# Altium schematic sheet Sheet_1.SchDoc
size A4; SheetNumber: 1; SheetTotal: 1
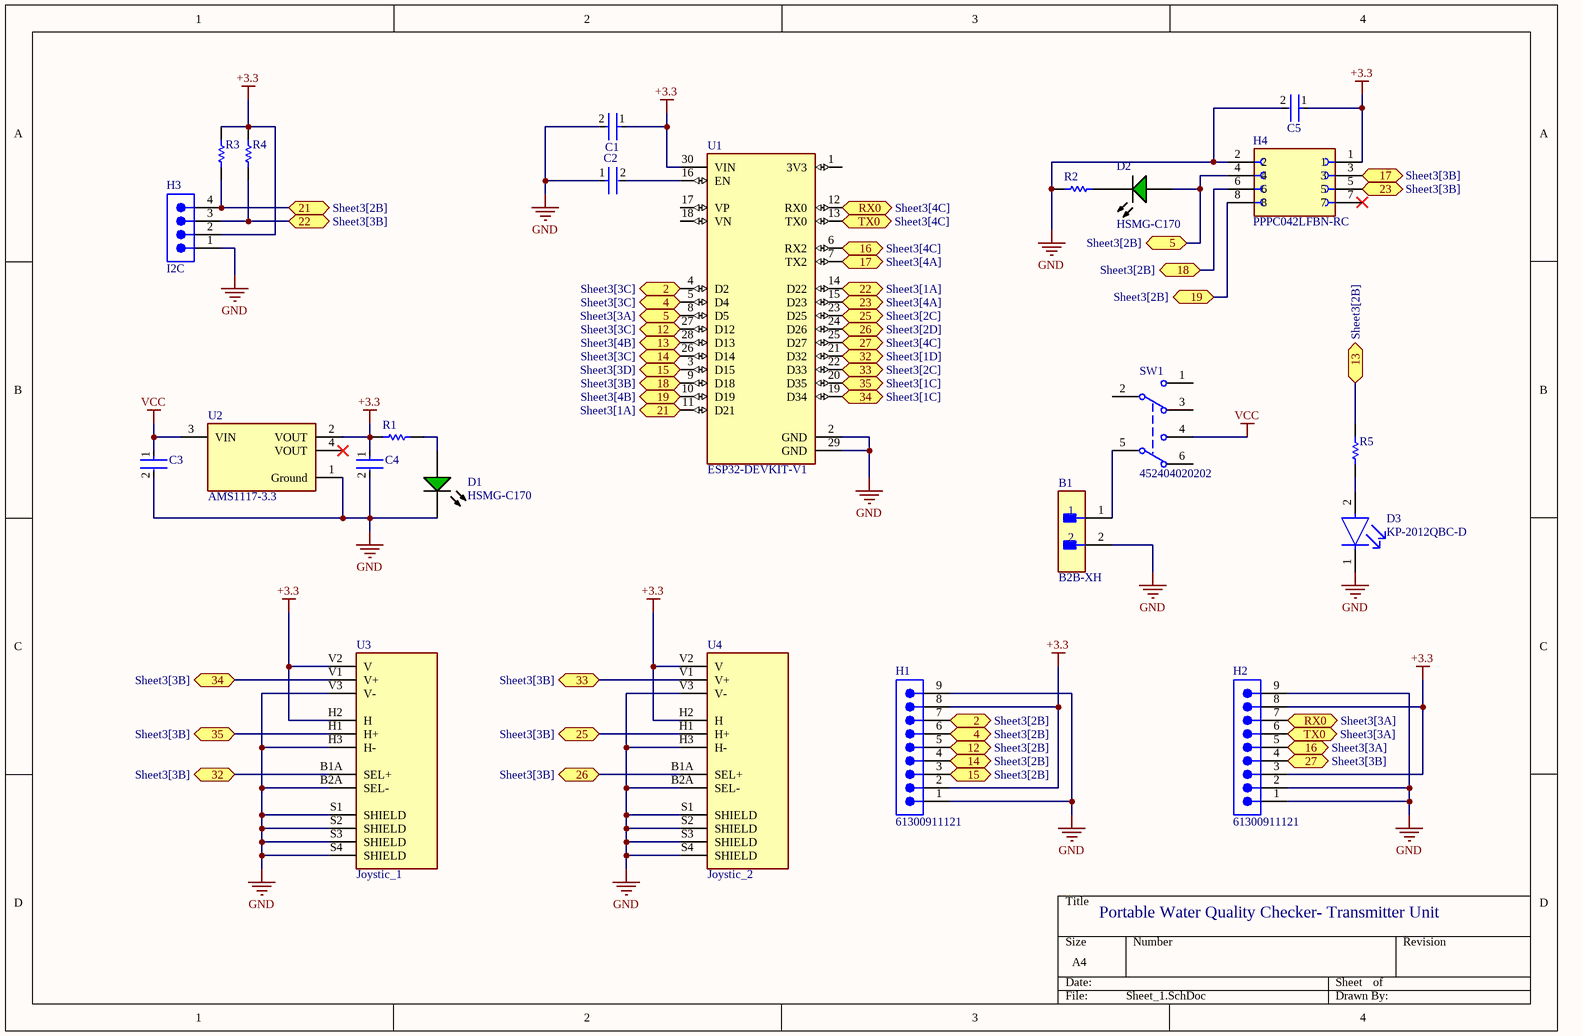
[diagram p0: Sheet_1.SchDoc]

## Parts
B1  B2B-XH  [FP-B2B-XH-AM_LF_SN-MFG]
C1  GRM21BR61C106KE15L  [FP-GRM21B-0_1-MFG]  (value not drawn)
C2  GRM21BR61C106KE15L  [FP-GRM21B-0_1-MFG]  (value not drawn)
C3  GRM21BR61C106KE15L  [FP-GRM21B-0_1-MFG]  (value not drawn)
C4  GRM21BR61C106KE15L  [FP-GRM21B-0_1-MFG]  (value not drawn)
C5  GRM21BR61C106KE15L  [FP-GRM21B-0_1-MFG]  (value not drawn)
D1  HSMG-C170  [AVAG-HSMX-C170_V]
D2  HSMG-C170  [AVAG-HSMX-C170_V]
D3  KP-2012QBC-D  [FP-KP-2012QBC-D-MFG]
H1  61300911121  [61300911121]
H2  61300911121  [61300911121]
H3  I2C  [61300411121]
H4  PPPC042LFBN-RC  [SULLINS_PPPC042LFBN-RC]
R1  ERJ6ENF3300V  [RESC2013X70X40NL20T20]  (value not drawn)
R2  ERJ6ENF3300V  [RESC2013X70X40NL20T20]  (value not drawn)
R3  ERJ-6ENF1002V  [RESC2013X70X40NL20T20]  (value not drawn)
R4  ERJ-6ENF1002V  [RESC2013X70X40NL20T20]  (value not drawn)
R5  ERJ-6ENF1002V  [RESC2013X70X40NL20T20]  (value not drawn)
SW1  452404020202  [452404020202]
U1  ESP32-DEVKIT-V1  [MODULE_ESP32_DEVKIT_V1]
U2  AMS1117-3.3  [FP-AMS1117-IPC_A]
U3  Joystic_1  [XDCR_COM-09032]
U4  Joystic_2  [XDCR_COM-09032]

## Ports
2 (bidir, see Sheet3[2B]), 2 (bidir, see Sheet3[3C]), 4 (bidir, see Sheet3[2B]), 4 (bidir, see Sheet3[3C]), 5 (bidir, see Sheet3[2B]), 5 (bidir, see Sheet3[3A]), 12 (bidir, see Sheet3[2B]), 12 (bidir, see Sheet3[3C]), 13 (bidir, see Sheet3[2B]), 13 (bidir, see Sheet3[4B]), 14 (bidir, see Sheet3[2B]), 14 (bidir, see Sheet3[3C]), 15 (bidir, see Sheet3[2B]), 15 (bidir, see Sheet3[3D]), 16 (bidir, see Sheet3[3A]), 16 (bidir, see Sheet3[4C]), 17 (bidir, see Sheet3[3B]), 17 (bidir, see Sheet3[4A]), 18 (bidir, see Sheet3[2B]), 18 (bidir, see Sheet3[3B]), 19 (bidir, see Sheet3[2B]), 19 (bidir, see Sheet3[4B]), 21 (bidir, see Sheet3[1A]), 21 (bidir, see Sheet3[2B]), 22 (bidir, see Sheet3[1A]), 22 (bidir, see Sheet3[3B]), 23 (bidir, see Sheet3[3B]), 23 (bidir, see Sheet3[4A]), 25 (bidir, see Sheet3[2C]), 25 (bidir, see Sheet3[3B]), 26 (bidir, see Sheet3[2D]), 26 (bidir, see Sheet3[3B]), 27 (bidir, see Sheet3[3B]), 27 (bidir, see Sheet3[4C]), 32 (bidir, see Sheet3[1D]), 32 (bidir, see Sheet3[3B]), 33 (bidir, see Sheet3[2C]), 33 (bidir, see Sheet3[3B]), 34 (bidir, see Sheet3[1C]), 34 (bidir, see Sheet3[3B]), 35 (bidir, see Sheet3[1C]), 35 (bidir, see Sheet3[3B]), RX0 (bidir, see Sheet3[3A]), RX0 (bidir, see Sheet3[4C]), TX0 (bidir, see Sheet3[3A]), TX0 (bidir, see Sheet3[4C])

## Nets
+3.3: C1.1 C4.1 C5.1 H1.2 H1.8 H2.3 H2.8 H3.2 H4.1 R1.1 R3.2 R4.2 U1.30(VIN) U2.2(VOUT) U3.H2(H) U3.V2(V) U4.H2(H) U4.V2(V)
GND: B1.2 C1.2 C2.1 C3.2 C4.2 C5.2 D1.2(K) D3.1(C) H1.1 H1.9 H2.1 H2.2 H2.9 H3.1 H4.2 R2.1 U1.2(GND) U1.29(GND) U2.1(Ground) U3.B2A(SEL-) U3.H3(H-) U3.S1(SHIELD) U3.S2(SHIELD) U3.S3(SHIELD) U3.S4(SHIELD) U3.V3(V-) U4.B2A(SEL-) U4.H3(H-) U4.S1(SHIELD) U4.S2(SHIELD) U4.S3(SHIELD) U4.S4(SHIELD) U4.V3(V-)
VCC: C3.1 SW1.4 U2.3(VIN)
2: H1.7 U1.4(D2) ; port 2
4: H1.6 U1.5(D4) ; port 4
5: D2.1(A) H4.4 U1.8(D5) ; port 5
12: H1.5 U1.27(D12) ; port 12
13: R5.2 U1.28(D13) ; port 13
14: H1.4 U1.26(D14) ; port 14
15: H1.3 U1.3(D15) ; port 15
16: H2.5 U1.6(RX2) ; port 16
17: H4.3 U1.7(TX2) ; port 17
18: H4.6 U1.9(D18) ; port 18
19: H4.8 U1.10(D19) ; port 19
21: H3.4 R3.1 U1.11(D21) ; port 21
22: H3.3 R4.1 U1.14(D22) ; port 22
23: H4.5 U1.15(D23) ; port 23
25: U1.23(D25) U4.H1(H+) ; port 25
26: U1.24(D26) U4.B1A(SEL+) ; port 26
27: H2.4 U1.25(D27) ; port 27
32: U1.21(D32) U3.B1A(SEL+) ; port 32
33: U1.22(D33) U4.V1(V+) ; port 33
34: U1.19(D34) U3.V1(V+) ; port 34
35: U1.20(D35) U3.H1(H+) ; port 35
RX0: H2.7 U1.12(RX0) ; port RX0
TX0: H2.6 U1.13(TX0) ; port TX0
NetB1_1: B1.1 SW1.5
NetC2_2: C2.2 U1.16(EN)
NetD1_1: D1.1(A) R1.2
NetD2_2: D2.2(K) R2.2
NetD3_2: D3.2(A) R5.1

Not connected (* = marked no-connect by the designer): H4 7*; SW1 1 2 3 6; U1 1(3V3) 17(VP) 18(VN); U2 4(VOUT)*

## Notes on the sheet
- Portable Water Quality Checker- Transmitter Unit

## Library data of the parts
B1 = CMP-17439-000037-1: CONN HEADER VERT 2POS 2.5MM; Max Voltage Rating (AC): 250V; Connector Type: Male Pin; Contact Resistance: 20mR; Max Current Rating: 3A; Number of Positions: 2; Series: XH; Contact Material: Brass; Mount: Through Hole; Housing Material: Polyamide; Contact Plating: Tin; Termination: Solder; Max Operating Temperature: 85°C; Depth: 5.75mm; Packaging: Bulk; Min Operating Temperature: -25°C; Contact Type: Male Pin; Color: Green; Pitch: 2.5mm; Length: 7.4mm; Lead Free: Lead Free; Number of Rows: 1; Fastening Type: Detent; Housing Color: White; Orientation: Straight
C1-C5 = CMP-2007-03453-2: Chip Multilayer Ceramic Capacitors for General Purpose, 0805, 10uF, X5R, 15%, 10%, 16V; Radiation Hardening: No; Thickness: 0.053inch; Voltage Rating (DC): 16V; Lead Free: Lead Free; Package Quantity: 1; Width: 1.25mm; Case Code (Imperial): 0805; Depth: 1.25mm; Packaging: Tape and Reel; Dielectric: X5R; Max Operating Temperature: 85°C; Tolerance: 10%; Voltage Rating: 16V; Voltage: 16V; Capacitance: 10uF; Height: 1.25mm; Case Code (Metric): 2012; Material: Ceramic; Mount: Surface Mount; Case/Package: 0805; REACH SVHC: No SVHC; Length: 2mm; Min Operating Temperature: -55°C; Termination: SMD/SMT
D1 D2 = CMP-2000-05062-1: Chip LED, Green, 2.2 V, -40 to 85 degC, 2-Pin SMD, Pb-Free, Tape and Reel; Manufacturer: Avago; No. of Pins: 2; Peak Wavelength: 570nm; SVHC: NoSVHC(16-Jun-2014); Dominant Wavelength: 572nm; Forward Current If: 20mA; Viewing Angle: 170deg; Lens Shape: Rectangular; PIV Max: 5V; External Width: 1.25mm; LED Type: Standard; External Depth: 0.8mm; Opto Mounting Orientation: Top; Luminous Intensity: 15mcd; Luminous Intensity Min: 4mcd; Forward Voltage VF Max: 2.6V; External Length / Height: 2mm; Bulb Size: 1.25mmx1.4mm; Light Area Height: 1mm; Voltage Vf Typ: 2.2V; Operating Temperature Max: 85degC; Datasheet Version: Oct-08; MSL: MSL2A-4weeks; Peak Forward Current: 20mA; Package Description: 2-Pin Surface Mount Device, Body 2 x 1.25 mm, Height 0.8 mm; Datasheet URL: https://datasheet.ciiva.com/29280/180495-da-01-en-chip-led-hsmg-c170-gelb-gruen-29280971.pdf; Storage Temperature Min: -40degC; LED Colour: Green; Wavelength Typ: 570nm; Mounting Type: SMD; Forward Current If Max: 20mA; Dominant Wavelength Typ: 572nm; LED Mounting: SMD; Operating Temperature Range: -30degCto+85degC; Operating Temperature Min: -30degC; Manufacturer URL: http://www.avagotech.com/; Packaging: CutTape; Luminous Intensity Typ: 15mcd; Package Reference: HSMX-C170; Storage Temperature Max: 85degC; Opto Case Style: SMD; Forward Voltage: 2.2V
D3 = CMP-44529-000058-1: LED, Low Power, Blue, SMD, 0805 [2012 Metric], 20 mA, 3.3 V, 465 nm; Wavelength: 465nm; Lens Color: Clear; Number of LEDs: 1; Viewing Angle: 120°; Luminous Intensity: 100mcd; Dominant Wavelength: 470nm; Forward Voltage: 3.3V; Lens Style: Diffused; Forward Current: 20mA; Color: Blue; Packaging: Tape and Reel; Width: 2mm; Number of Pins: 2; Radiation Hardening: No; Series: KP; Length: 1.25mm; REACH SVHC: No SVHC; Case/Package: 2012; Mount: Surface Mount; Height: 1.1mm; RoHS Compliant: Yes
H1 H2 = CMP-1502-01080-3: NexarPartId: 32855536; Current Rating: 3A; Connector Type: Male Pin; Operating Supply Voltage: 250V; Contact Resistance: 20mΩ; Pitch: 2.54mm; Number of Contacts: 9; Gender: Male; Lead Pitch: 2.54mm; REACH SVHC: Unknown; Number of Rows: 1; Mount: Through Hole; Contact Plating: Gold; Color: Black; Number of Pins: 9; Orientation: Vertical; Contact Material: Copper; Packaging: Bulk; Contact Mating Length: 5.9944mm; RoHS: Compliant; Number of Positions: 9; Termination: Solder
H3 = CMP-1502-01064-3: NexarPartId: 32855522; Operating Supply Voltage: 250V; Pitch: 2.54mm; Contact Resistance: 20mΩ; Number of Positions: 4; Current Rating: 3A; Connector Type: Male Pin; Gender: Male; Contact Plating: Gold; Height: 8.89mm; Lead Pitch: 2.54mm; Lead Free: Lead Free; Contact Mating Length: 5.9944mm; Number of Rows: 1; Termination: Solder; Packaging: Bulk; REACH SVHC: Unknown; Min Operating Temperature: -40°C; RoHS: Compliant; Number of Contacts: 4; Voltage Rating: 250V; Color: Black; Max Operating Temperature: 105°C; Contact Material: Copper; Mount: Through Hole; Orientation: Vertical; Number of Pins: 4
H4 = PPPC042LFBN-RC: 8 Position Total Dual Row 2.54 mm Pitch Straight Female Header; MF: Sullins Connector Solutions; MP: PPPC042LFBNRC; SnapEDA_Link: https://www.snapeda.com/parts/PPPC042LFBNRC/Sullins/view-part/?ref=snap; Package: None; Value: *; Check_prices: https://www.snapeda.com/parts/PPPC042LFBNRC/Sullins/view-part/?ref=eda
R1 R2 = CMP-2001-00532-1: Manufacturer: Panasonic; Part Number: ERJ6ENF3300V
R3-R5 = CMP-2001-04376-1: Manufacturer: Panasonic; Part Number: ERJ-6ENF1002V
SW1 = CMP-03913-99472345-1: 452404020202 Slide Switch, Dpdt, 0.3A, 6Vdc, Tht Rohs Compliant: Yes |Wurth Elektronik 452404020202; Insulation Resistance: 100MΩ; Voltage Rating: 6V; Current Rating: 300mA; Min Operating Temperature: -40°C; Contact Plating: Silver; Max Operating Temperature: 85°C; Packaging: Bulk; NexarPartId: 99472345
U1 = ESP32-DEVKIT-V1: Dual core, Wi-Fi: 2.4 GHz up to 150 Mbits/s,BLE (Bluetooth Low Energy) and legacy Bluetooth, 32 bits, Up to 240 MHz; MF: Do it; SnapEDA_Link: https://www.snapeda.com/parts/ESP32-DEVKIT-V1/Do+it/view-part/?ref=snap; Package: None; Value: *; MP: ESP32-DEVKIT-V1; Check_prices: https://www.snapeda.com/parts/ESP32-DEVKIT-V1/Do+it/view-part/?ref=eda
U2 = CMP-209535-000001-1: LDO Voltage Regulators 1A, 3.3V; Manufacturer: Advanced Monolithic Systems; Dropout Voltage: 1.1V; Output Type: Fixed; Nominal Supply Current: 5mA; Max Power Dissipation: 1.2W; Max Supply Voltage: 15V; Number Of Outputs: 1; Standoff Height: 0.64mm; Max Junction Temp: +125°C; Height: 1.8mm; Package: AMS1117; Device Class L2: Power Management ICs; ComponentLink2Description: Datasheet; ComponentLink2URL: http://www.advanced-monolithic.com/pdf/ds1117.pdf; Category: IC; RoHS: TRUE; Automotive: No; Device Class L1: Integrated Circuits (ICs); Output Current: 1A; Device Class L3: Voltage Regulators - Linear; Temperature: -40°C to +125°C; Output Voltage: 3.3V; Manufacturer Part Number: AMS1117-3.3; Temperature Range Low: -40°C; Octopart: https://octopart.com/ams1117-3.3-advanced+monolithic+systems-25899300; Lead Free: Yes; Ipc Land Pattern Name: SOT229P700X180-4; Temperature Range High: +125°C
U3 U4 = COM-09032: Thumb Joystick; Price: None; Availability: Unavailable; MP: COM-09032; Value: *; Package: None